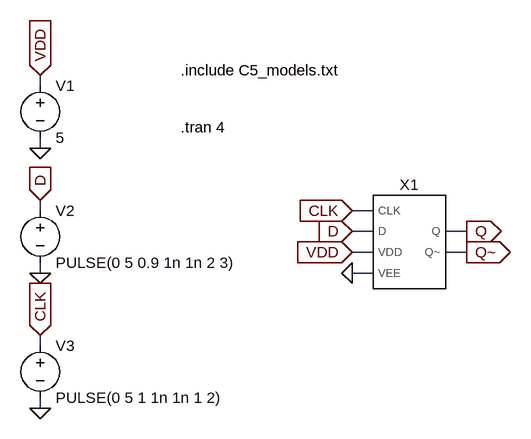
[diagram p0: schematic D_Latch_Symbol_Test.asc]
D_Latch_Symbol_Test.asc, the LTspice schematic file:
Version 4
SHEET 1 880 680
WIRE -48 144 -48 128
WIRE -48 240 -48 224
WIRE -48 336 -48 320
WIRE 464 336 432 336
WIRE 464 368 432 368
WIRE 608 368 576 368
WIRE 464 400 432 400
WIRE 608 400 576 400
WIRE -48 432 -48 416
WIRE 464 432 432 432
WIRE -48 544 -48 528
WIRE -48 640 -48 624
FLAG -48 640 0
FLAG -48 432 0
FLAG -48 240 0
FLAG -48 128 VDD
IOPIN -48 128 In
FLAG -48 320 D
IOPIN -48 320 In
FLAG -48 528 CLK
IOPIN -48 528 In
FLAG 432 368 D
IOPIN 432 368 In
FLAG 432 336 CLK
IOPIN 432 336 In
FLAG 432 400 VDD
IOPIN 432 400 In
FLAG 432 432 0
FLAG 608 368 Q
IOPIN 608 368 Out
FLAG 608 400 Q~
IOPIN 608 400 Out
SYMBOL Voltage -48 128 R0
SYMATTR InstName V1
SYMATTR Value 5
SYMBOL Voltage -48 320 R0
SYMATTR InstName V2
SYMATTR Value PULSE(0 5 0.9 1n 1n 2 3)
SYMBOL Voltage -48 528 R0
SYMATTR InstName V3
SYMATTR Value PULSE(0 5 1 1n 1n 1 2)
SYMBOL D_Latch_Symbol 512 384 R0
SYMATTR InstName X1
TEXT 168 208 Left 2 !.tran 4
TEXT 168 120 Left 2 !.include C5_models.txt

The netlist it stands for:
* D_Latch_Symbol_Test.asc
V1 VDD 0 5
V2 D 0 PULSE(0 5 0.9 1n 1n 2 3)
V3 CLK 0 PULSE(0 5 1 1n 1n 1 2)
XX1 CLK D VDD 0 Q Q~ D_Latch_Symbol  ; pins CLK D VDD VEE Q Q~
.tran 4
.include C5_models.txt
.backanno
.end